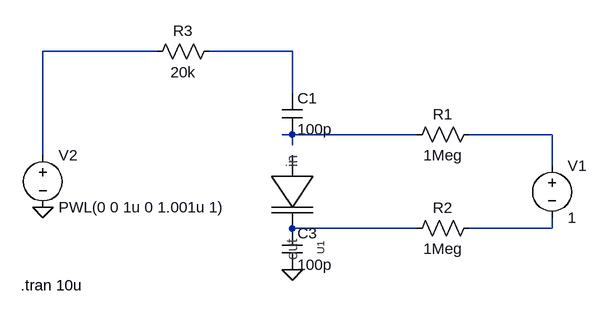
[diagram p0: schematic varicap_testing.asc]
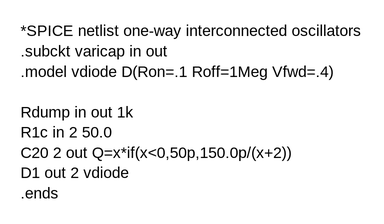
[diagram p1: sub-circuit varicap.asc]
varicap_testing.asc, the LTspice schematic file:
Version 4
SHEET 1 2020 888
WIRE -208 -464 -384 -464
WIRE 0 -464 -128 -464
WIRE 0 -400 0 -464
WIRE 0 -336 -16 -336
WIRE 192 -336 0 -336
WIRE 400 -336 272 -336
WIRE 0 -320 0 -336
WIRE -384 -304 -384 -464
WIRE 400 -288 400 -336
WIRE 0 -192 0 -208
WIRE 192 -192 0 -192
WIRE 400 -192 400 -208
WIRE 400 -192 272 -192
FLAG 0 -128 0
FLAG -384 -224 0
SYMBOL cap -16 -400 R0
SYMATTR InstName C1
SYMATTR Value 100p
SYMBOL cap -16 -192 R0
SYMATTR InstName C3
SYMATTR Value 100p
SYMBOL AutoGenerated\\varicap 0 -272 R90
SYMATTR InstName U1
SYMBOL voltage 400 -304 R0
WINDOW 123 0 0 Left 0
WINDOW 39 0 0 Left 0
SYMATTR InstName V1
SYMATTR Value 1
SYMBOL voltage -384 -320 R0
WINDOW 123 0 0 Left 0
WINDOW 39 0 0 Left 0
SYMATTR InstName V2
SYMATTR Value PWL(0 0 1u 0 1.001u 1)
SYMBOL res 288 -352 R90
WINDOW 0 0 56 VBottom 2
WINDOW 3 32 56 VTop 2
SYMATTR InstName R1
SYMATTR Value 1Meg
SYMBOL res 288 -208 R90
WINDOW 0 0 56 VBottom 2
WINDOW 3 32 56 VTop 2
SYMATTR InstName R2
SYMATTR Value 1Meg
SYMBOL res -112 -480 R90
WINDOW 0 0 56 VBottom 2
WINDOW 3 32 56 VTop 2
SYMATTR InstName R3
SYMATTR Value 20k
TEXT -418 -104 Left 2 !.tran 10u

varicap.asc, the sub-circuit schematic file:
Version 4
SHEET 1 1188 680
TEXT -24 72 Left 2 !*SPICE netlist one-way interconnected oscillators\n.subckt varicap in out\n.model vdiode D(Ron=.1 Roff=1Meg Vfwd=.4)\n \nRdump in out 1k \nR1c in 2 50.0\nC20 2 out Q=x*if(x<0,50p,150.0p/(x+2))\nD1 out 2 vdiode\n.ends

The netlist it stands for:
* varicap_testing.asc
C1 N002 N003 100p
C3 N005 0 100p
XU1 varicap
V1 N004 N006 1
V2 N001 0 PWL(0 0 1u 0 1.001u 1)
R1 N004 N003 1Meg
R2 N006 N005 1Meg
R3 N002 N001 20k

* block symbol definitions
.subckt varicap 
*SPICE netlist one-way interconnected oscillators
.subckt varicap in out
.model vdiode D(Ron=.1 Roff=1Meg Vfwd=.4)
Rdump in out 1k
R1c in 2 50.0
C20 2 out Q=x*if(x<0,50p,150.0p/(x+2))
D1 out 2 vdiode
.ends
.ends varicap

.tran 10u
.backanno
.end